# Altium schematic sheet PCB_LineFollowerFullPCB.schdoc
size 519 x 307 mm
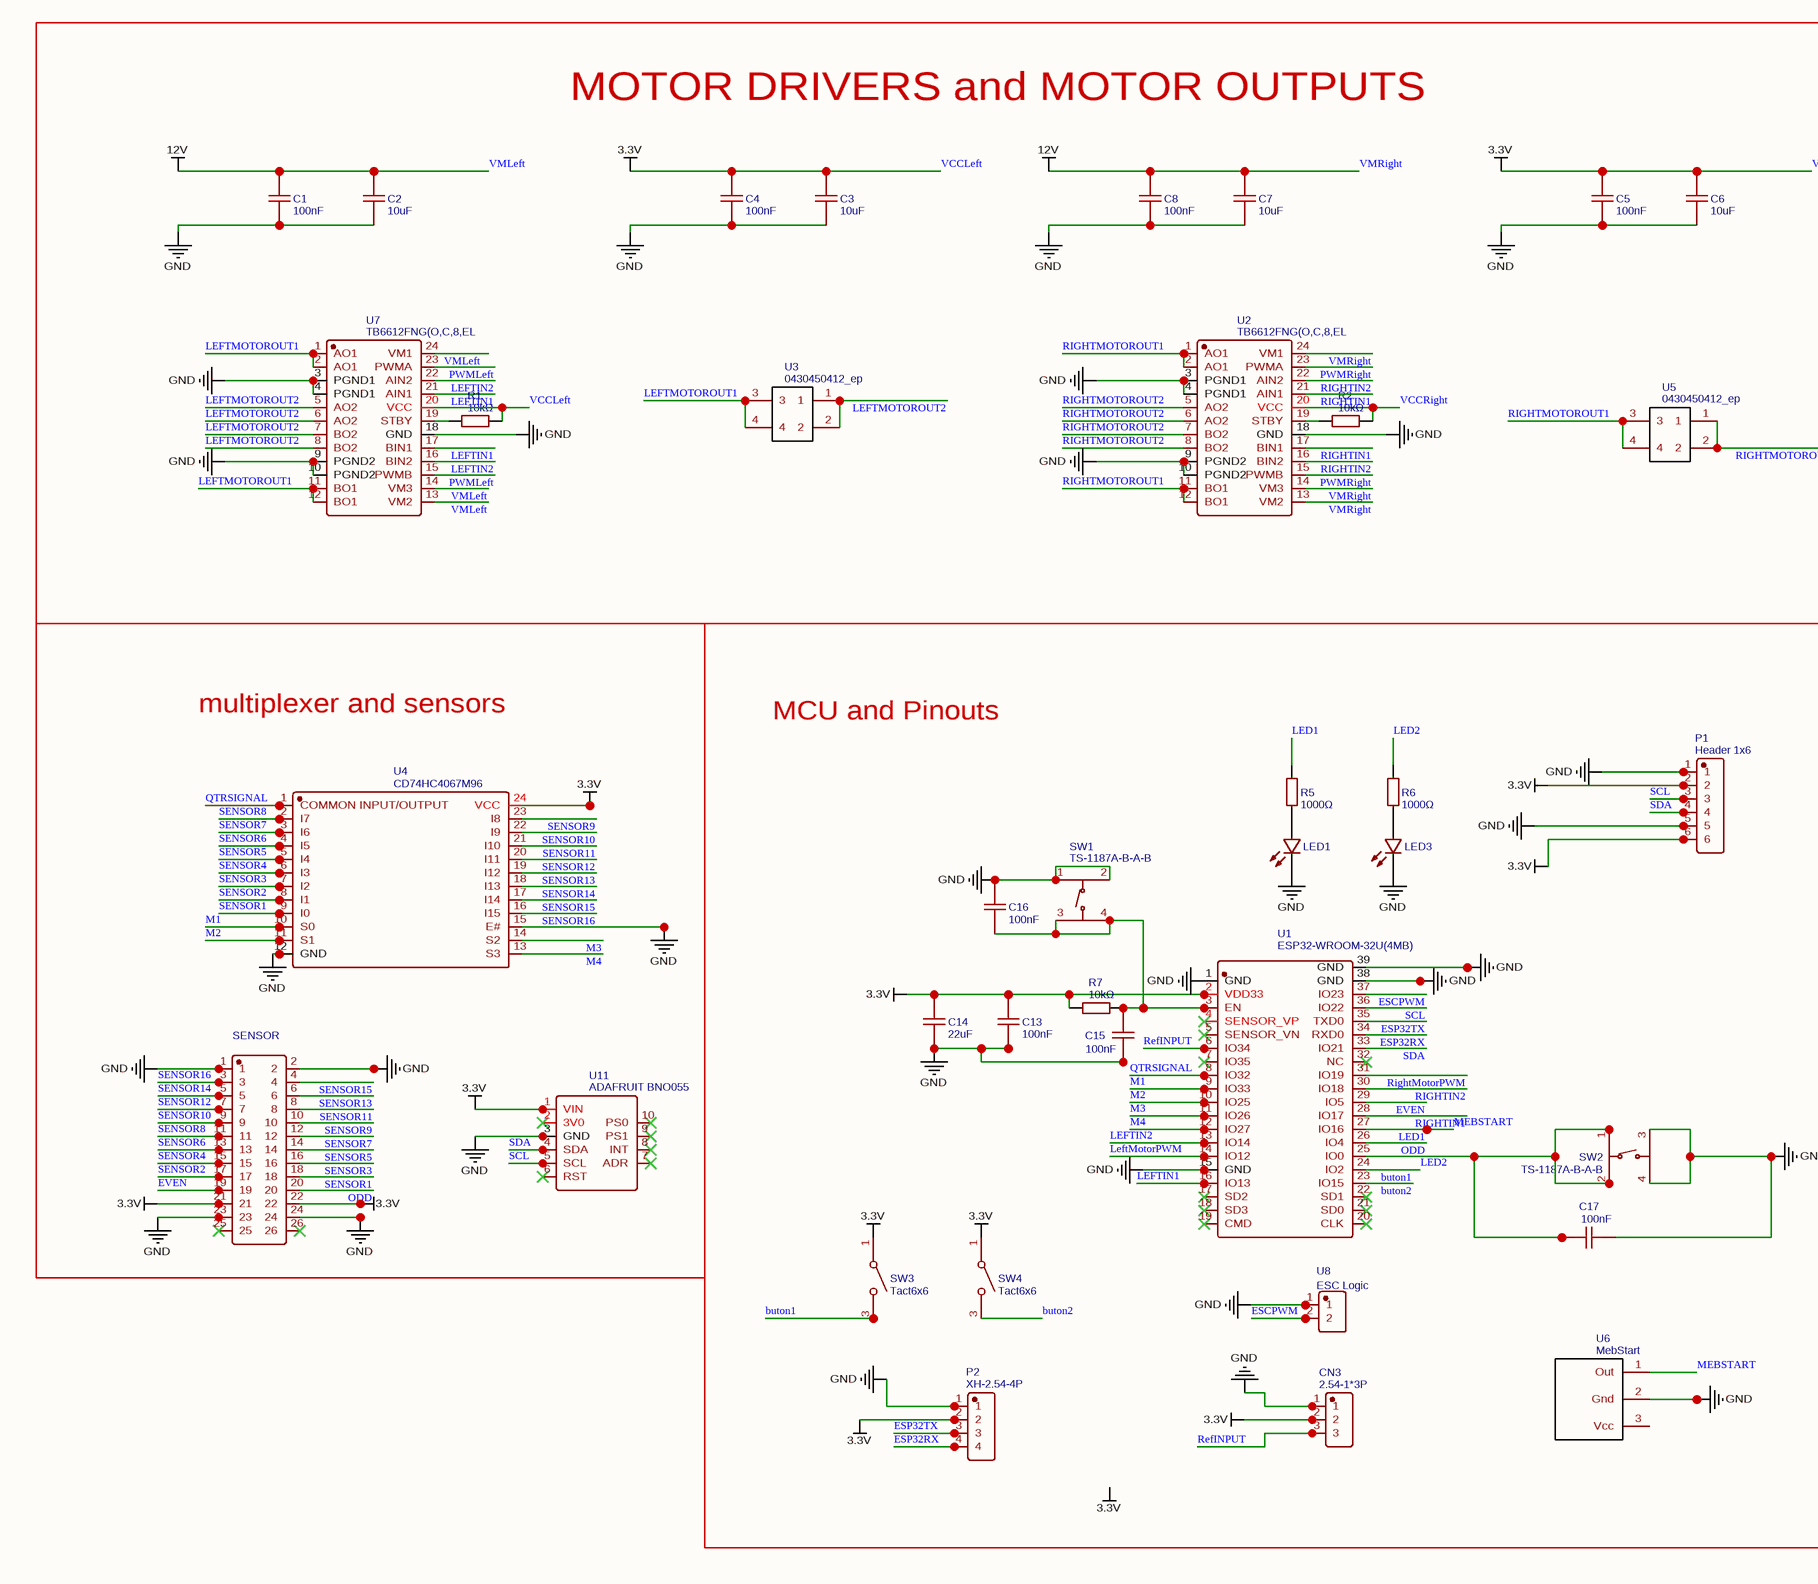
[diagram p0: PCB_LineFollowerFullPCB.schdoc, left]
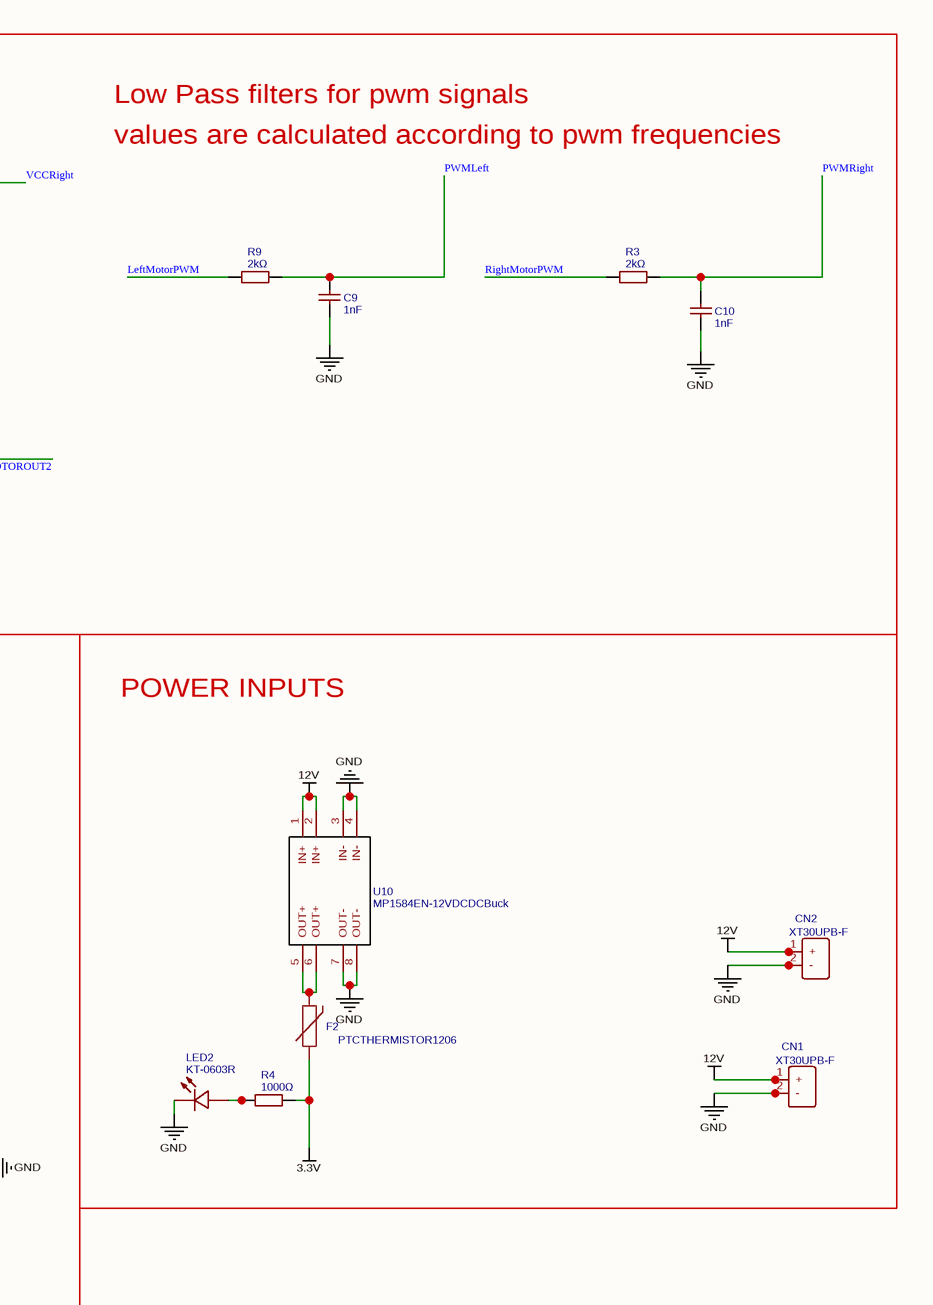
[diagram p1: PCB_LineFollowerFullPCB.schdoc, right]

## Parts
C1  100nF  [C0603]
C2  10uF  [C0603]
C3  10uF  [C0603]
C4  100nF  [C0603]
C5  100nF  [C0603]
C6  10uF  [C0603]
C7  10uF  [C0603]
C8  100nF  [C0603]
C9  1nF  [C0603]
C10  1nF  [C0603]
C13  100nF  [C0603]
C14  22uF  [C0603]
C15  100nF  [C0603]
C16  100nF  [C0603]
C17  100nF  [C0603]
CN1  XT30UPB-F  [CONN-TH_XT30UPB-F]
CN2  XT30UPB-F  [CONN-TH_XT30UPB-F]
CN3  2.54-1*3P  [CONN-TH_C722693]
F2  PTCTHERMISTOR1206  [PTC-1206]
LED1  19-217/BHC-ZL1M2RY/3T  [LED0603-FD_BLUE]  (value not drawn)
LED2  KT-0603R  [LED0603-RD]
LED3  19-217/BHC-ZL1M2RY/3T  [LED0603-FD_BLUE]  (value not drawn)
P1  Header 1x6  [1X6-PIN-HEADER-2.54MM_ES]
P2  XH-2.54-4P  [CONN-TH_4P-P2.50-XH2.54-4P]
R1  10kΩ  [R0603]
R2  10kΩ  [R0603]
R3  2kΩ  [R0603]
R4  1000Ω  [R0603]
R5  1000Ω  [R0603]
R6  1000Ω  [R0603]
R7  10kΩ  [R0603]
R9  2kΩ  [R0603]
SENSOR  X9555WV-2X13E-PTV01  [CONN-TH_26P-P2.54_XKB_X9555WV-2X13E-PTV01]  (value not drawn)
SW1  TS-1187A-B-A-B  [SW-SMD_4P-L5.1-W5.1-P3.70-LS6.5-TL-2]
SW2  TS-1187A-B-A-B  [SW-SMD_4P-L5.1-W5.1-P3.70-LS6.5-TL-2]
SW3  Tact6x6  [TACTILE_SWITCH_6X6]
SW4  Tact6x6  [TACTILE_SWITCH_6X6]
U1  ESP32-WROOM-32U(4MB)  [WIFI-SMD_ESP32-WROOM-32UE-A]
U2  TB6612FNG(O,C,8,EL  [SSOP-24_L8.4-W5.8-P0.65-LS7.8-BL]
U3  0430450412_ep  [0430450412_EP]
U4  CD74HC4067M96  [SOIC-24_L15.4-W7.5-P1.27-LS10.3-BL]
U5  0430450412_ep  [0430450412_EP]
U6  MebStart  [MEBSTART_MODUL]
U7  TB6612FNG(O,C,8,EL  [SSOP-24_L8.4-W5.8-P0.65-LS7.8-BL]
U8  ESC Logic  [CONN-TH_2P-P2.50-XH2.54-2P]
U10  MP1584EN-12VDCDCBuck  [MP1584]
U11  ADAFRUIT BNO055  [ADAFRUIT-BNO055_NO_HOLES]

## Blocks framed on the sheet
MOTOR DRIVERS and MOTOR OUTPUTS: C1-C10 R1-R3 R9 U2 U3 U5 U7
multiplexer and sensors: SENSOR U4 U11
MCU and Pinouts: C13-C17 CN3 LED1 LED3 P1 P2 R5-R7 SW1-SW4 U1 U6 U8
POWER INPUTS: CN1 CN2 F2 LED2 R4 U10

## Nets
GND: C1.2 C2.2 C3.2 C4.2 C5.2 C6.2 C7.2 C8.2 C9.2 C10.2 C13.2 C14.1 C15.2 C16.1 C17.2 CN1.2(-) CN2.2(-) CN3.1 LED1.1(C) LED2.1(K) LED3.1(C) P1.1 P1.5 P2.1 SENSOR.1 SENSOR.2 SENSOR.23 SENSOR.24 SW1.1(A) SW1.2(B) SW2.3(C) SW2.4(D) U1.1(GND) U1.15(GND) U1.38(GND) U1.39(GND) U2.3(PGND1) U2.4(PGND1) U2.9(PGND2) U2.10(PGND2) U2.18(GND) U4.12(GND) U4.15(E#) U6.2(Gnd) U7.3(PGND1) U7.4(PGND1) U7.9(PGND2) U7.10(PGND2) U7.18(GND) U8.1 U10.3(IN-) U10.4(IN-) U10.7(OUT-) U10.8(OUT-) U11.3(GND)
VCCLeft: C3.1 C4.1 C5.1 C6.1 C13.1 C14.2 CN3.2 F2.1 P1.2 P1.6 P2.2 R1.2 R2.2 R4.2 R7.1 SENSOR.21 SENSOR.22 SW3.1 SW4.1 U1.2(VDD33) U2.20(VCC) U4.24(VCC) U7.20(VCC) U11.1(VIN)  [also labelled 3.3V, VCCRight]
VMLeft: C1.1 C2.1 C7.1 C8.1 CN1.1(+) CN2.1(+) U2.13(VM2) U2.14(VM3) U2.24(VM1) U7.13(VM2) U7.14(VM3) U7.24(VM1) U10.1(IN+) U10.2(IN+)  [also labelled 12V, VMRight]
buton1: R6.1 SW3.3 U1.24(IO2)  [also labelled LED2]
buton2: SW4.3 U1.23(IO15)
ESCPWM: U1.37(IO23) U8.2
ESP32RX: P2.4 U1.34(RXD0)
ESP32TX: P2.3 U1.35(TXD0)
EVEN: SENSOR.19 U1.29(IO5)
LED1: R5.1 U1.27(IO16) U6.1(Out)  [also labelled MEBSTART]
LEFTIN1: U1.16(IO13) U7.17(BIN1) U7.21(AIN1)
LEFTIN2: U1.13(IO14) U7.16(BIN2) U7.22(AIN2)
LEFTMOTOROUT1: U3.3 U3.4 U7.1(AO1) U7.2(AO1) U7.11(BO1) U7.12(BO1)
LEFTMOTOROUT2: U3.1 U3.2 U7.5(AO2) U7.6(AO2) U7.7(BO2) U7.8(BO2)
LeftMotorPWM: R9.1 U1.14(IO12)
M1: U1.9(IO33) U4.10(S0)
M2: U1.10(IO25) U4.11(S1)
M3: U1.11(IO26) U4.14(S2)
M4: U1.12(IO27) U4.13(S3)
ODD: SENSOR.20 U1.26(IO4)
PWMLeft: C9.1 R9.2 U7.15(PWMB) U7.23(PWMA)
PWMRight: C10.1 R3.2 U2.15(PWMB) U2.23(PWMA)
QTRSIGNAL: U1.8(IO32) U4.1(COMMON_INPUT/OUTPUT)
RefINPUT: CN3.3 U1.6(IO34)
RIGHTIN1: U1.28(IO17) U2.17(BIN1) U2.21(AIN1)
RIGHTIN2: U1.30(IO18) U2.16(BIN2) U2.22(AIN2)
RIGHTMOTOROUT1: U2.1(AO1) U2.2(AO1) U2.11(BO1) U2.12(BO1) U5.3 U5.4
RIGHTMOTOROUT2: U2.5(AO2) U2.6(AO2) U2.7(BO2) U2.8(BO2) U5.1 U5.2
RightMotorPWM: R3.1 U1.31(IO19)
SCL: P1.3 U1.36(IO22) U11.5(SCL)
SDA: P1.4 U1.33(IO21) U11.4(SDA)
SENSOR1: SENSOR.18 U4.9(I0)
SENSOR2: SENSOR.17 U4.8(I1)
SENSOR3: SENSOR.16 U4.7(I2)
SENSOR4: SENSOR.15 U4.6(I3)
SENSOR5: SENSOR.14 U4.5(I4)
SENSOR6: SENSOR.13 U4.4(I5)
SENSOR7: SENSOR.12 U4.3(I6)
SENSOR8: SENSOR.11 U4.2(I7)
SENSOR9: SENSOR.10 U4.23(I8)
SENSOR10: SENSOR.9 U4.22(I9)
SENSOR11: SENSOR.8 U4.21(I10)
SENSOR12: SENSOR.7 U4.20(I11)
SENSOR13: SENSOR.6 U4.19(I12)
SENSOR14: SENSOR.5 U4.18(I13)
SENSOR15: SENSOR.4 U4.17(I14)
SENSOR16: SENSOR.3 U4.16(I15)
NetC15_1: C15.1 C16.2 R7.2 SW1.3(C) SW1.4(D) U1.3(EN)
NetC17_1: C17.1 SW2.1(A) SW2.2(B) U1.25(IO0)
NetF2_2: F2.2 U10.5(OUT+) U10.6(OUT+)
NetLED1_2: LED1.2(A) R5.2
NetLED2_2: LED2.2(A) R4.1
NetLED3_2: LED3.2(A) R6.2
NetR1_1: R1.1 U7.19(STBY)
NetR2_1: R2.1 U2.19(STBY)

Not connected (* = marked no-connect by the designer): SENSOR 25* 26*; U1 4(SENSOR_VP)* 5(SENSOR_VN)* 7(IO35)* 17(SD2)* 18(SD3)* 19(CMD)* 20(CLK)* 21(SD0)* 22(SD1)* 32(NC)*; U6 3(Vcc); U11 2(3V0)* 6(RST)* 7(ADR)* 8(INT)* 9(PS1)* 10(PS0)*

## Notes on the sheet
- Low Pass filters for pwm signals
- values are calculated according to pwm frequencies
- Labels drawn without touching a wire or pin: 3.3V

## Library data of the parts
C1 C4 C5 C8 C13 C15-C17 = 100nF: Manufacturer: YAGEO(国巨); Manufacturer Part: CC0603KRX7R9BB104; nameAlias: Value; Supplier: LCSC; Supplier Part: C14663; JLCPCB Part Class: Basic Part; link: https://lcsc.com/eda_search?q=C14663&%26type=1&ref=editor; spicePre: C; spiceSymbolName: CC0603KRX7R9BB104
C2 C3 C6 C7 = 10uF: Manufacturer: SAMSUNG(三星); Manufacturer Part: CL10A106MA8NRNC; nameAlias: Value; Supplier: LCSC; Supplier Part: C96446; JLCPCB Part Class: Basic Part; link: https://lcsc.com/eda_search?q=C96446&%26type=1&ref=editor; spicePre: C; spiceSymbolName: CL10A106MA8NRNC
C9 C10 = 1nF: Manufacturer Part: CL10B102KB8NNNC; Manufacturer: SAMSUNG(三星); nameAlias: Value; Supplier: LCSC; Supplier Part: C1588; JLCPCB Part Class: Basic Part; link: https://lcsc.com/eda_search?q=C1588&%26type=1&ref=editor; spicePre: C; spiceSymbolName: CL10B102KB8NNNC
C14 = 22uF: Manufacturer: SAMSUNG(三星); Manufacturer Part: CL10A226MQ8NRNC; nameAlias: Value; Supplier: LCSC; Supplier Part: C59461; JLCPCB Part Class: Basic Part; link: https://lcsc.com/eda_search?q=C59461&%26type=1&ref=editor; spicePre: C; spiceSymbolName: CL10A226MQ8NRNC
CN1 CN2 = XT30UPB-F: Manufacturer: AMASS(艾迈斯); Manufacturer Part: XT30UPB30-F.G.*; nameAlias: Value; Contributor: LCSC; Supplier: LCSC; Supplier Part: C108769; JLCPCB Part Class: Extended Part; link: https://lcsc.com/eda_search?q=C108769&%26type=1&ref=editor; spicePre: C; spiceSymbolName: XT30UPB-F
CN3 = 2.54-1*3P: Manufacturer: CAX(创都); Contributor: LCSC; Supplier: LCSC; Supplier Part: C722693; Manufacturer Part: 2.54-1*3P; JLCPCB Part Class: Extended Part; link: https://lcsc.com/eda_search?q=C722693&%26type=1&ref=editor; spicePre: C; spiceSymbolName: 2.54-1*3P
F2 = PTCTHERMISTOR1206: description: Resettable Fuse PTC; Contributor: varaksachin; spicePre: F; spiceSymbolName: PTCTHERMISTOR1206
LED1 LED3 = 19-217/BHC-ZL1M2RY/3T: Manufacturer: EVERLIGHT(亿光); Supplier: LCSC; Manufacturer Part: 19-217/BHC-ZL1M2RY/3T; Supplier Part: C72041; JLCPCB Part Class: Basic Part; link: https://lcsc.com/eda_search?q=C72041&%26type=1&ref=editor; spicePre: L; spiceSymbolName: 19-217/BHC-ZL1M2RY/3T
LED2 = KT-0603R: Manufacturer: KENTO; Supplier: LCSC; Manufacturer Part: KT-0603R; Supplier Part: C2286; JLCPCB Part Class: Basic Part; link: https://lcsc.com/eda_search?q=C2286&%26type=1&ref=editor; spicePre: L; spiceSymbolName: KT-0603R
P1 = Header 1x6: Manufacturer: XFCN; Manufacturer Part: M3025V-1x6P; Contributor: erzyk; Supplier: LCSC; Supplier Part: C705186; JLCPCB Part Class: Extended Part; spicePre: P; spiceSymbolName: Header 1x6
P2 = XH-2.54-4P: Manufacturer: null; Contributor: LCSC; Supplier: LCSC; Supplier Part: C9900003933; Manufacturer Part: XH-2.54-4P; JLCPCB Part Class: Extended Part; link: https://lcsc.com/eda_search?q=C9900003933&%26type=1&ref=editor; spicePre: P; spiceSymbolName: XH-2.54-4P
R1 R2 R7 = 10kΩ: Manufacturer: UNI-ROYAL(厚声); Manufacturer Part: 0603WAF1002T5E; nameAlias: Value; Supplier: LCSC; Supplier Part: C25804; JLCPCB Part Class: Basic Part; link: https://lcsc.com/eda_search?q=C25804&%26type=1&ref=editor; spicePre: R; spiceSymbolName: 0603WAF1002T5E
R3 R9 = 2kΩ: Manufacturer: UNI-ROYAL(厚声); Manufacturer Part: 0603WAF2001T5E; nameAlias: Value; Supplier: LCSC; Supplier Part: C22975; JLCPCB Part Class: Basic Part; link: https://lcsc.com/eda_search?q=C22975&%26type=1&ref=editor; spicePre: R; spiceSymbolName: 0603WAF2001T5E
R4 = 1000Ω: Manufacturer: UNI-ROYAL(厚声); Manufacturer Part: 0603WAF1000T5E; nameAlias: Value; Supplier: LCSC; Supplier Part: C22775; JLCPCB Part Class: Basic Part; link: https://lcsc.com/eda_search?q=C22775&%26type=1&ref=editor; spicePre: R; spiceSymbolName: 0603WAF1000T5E
R5 R6 = 1000Ω: Manufacturer: UNI-ROYAL(厚声); Manufacturer Part: 0603WAF510JT5E; nameAlias: Value; Supplier: LCSC; Supplier Part: C23197; JLCPCB Part Class: Basic Part; link: https://lcsc.com/eda_search?q=C23197&%26type=1&ref=editor; spicePre: R; spiceSymbolName: 0603WAF510JT5E
SENSOR = X9555WV-2X13E-PTV01: Manufacturer: XKB Connectivity(中国星坤); Contributor: LCSC; Supplier: LCSC; Supplier Part: C2884537; Manufacturer Part: X9555WV-2x13E-PTV01; JLCPCB Part Class: Extended Part; link: https://lcsc.com/eda_search?q=C2884537&%26type=1&ref=editor; spicePre: U; spiceSymbolName: X9555WV-2X13E-PTV01
SW1 SW2 = TS-1187A-B-A-B: Manufacturer: XKB Connectivity(中国星坤); Contributor: LCSC; Supplier: LCSC; Supplier Part: C318884; Manufacturer Part: TS-1187A-B-A-B; JLCPCB Part Class: Basic Part; link: https://lcsc.com/eda_search?q=C318884&%26type=1&ref=editor; spicePre: S; spiceSymbolName: TS-1187A-B-A-B
SW3 SW4 = Tact6x6: Manufacturer: BBJ; Manufacturer Part: Switch,6*6*6Plastic head,260G, 0.25mm,Straight line; Contributor: Richárd Tóth; Supplier Part: C71836; Supplier: LCSC; spicePre: S; spiceSymbolName: Tact6x6
U1 = ESP32-WROOM-32U(4MB): Manufacturer: ESPRESSIF(乐鑫); Manufacturer Part: ESP32-WROOM-32U-N4; Contributor: LCSC; Supplier: LCSC; Supplier Part: C2934572; JLCPCB Part Class: Extended Part; link: https://lcsc.com/eda_search?q=C2934572&%26type=1&ref=editor; spicePre: U; spiceSymbolName: ESP32-WROOM-32U(4MB)
U2 U7 = TB6612FNG(O,C,8,EL: Manufacturer: TOSHIBA(东芝); Supplier: LCSC; Manufacturer Part: TB6612FNG(O,C,8,EL; Supplier Part: C88224; JLCPCB Part Class: Extended Part; link: https://lcsc.com/eda_search?q=C88224&%26type=1&ref=editor; spicePre: U; spiceSymbolName: TB6612FNG(O,C,8,EL
U3 U5 = 0430450412_ep: Contributor: epsilor; spicePre: U; spiceSymbolName: 0430450412_ep
U4 = CD74HC4067M96: Manufacturer: TI(德州仪器); Contributor: LCSC; Supplier: LCSC; Supplier Part: C496123; Manufacturer Part: CD74HC4067M96; JLCPCB Part Class: Extended Part; link: https://lcsc.com/eda_search?q=C496123&%26type=1&ref=editor; spicePre: U; spiceSymbolName: CD74HC4067M96
U6 = MebStart: Contributor: cikkan; spicePre: U; spiceSymbolName: MebStart
U8 = ESC Logic: Manufacturer: null; Manufacturer Part: XH-2P-2.54; Contributor: LCSC; Convert to PCB: Yes; Add into BOM: Yes; Supplier: LCSC; Supplier Part: C9900003929; JLCPCB Part Class: Extended Part; link: https://lcsc.com/eda_search?q=C9900003929&%26type=1&ref=editor; spicePre: U; spiceSymbolName: XH-2P-2.54
U10 = MP1584EN-12VDCDCBuck: Manufacturer: eBoot; Contributor: pep9571; Manufacturer Part: MP1584EN; Supplier Part: MP1584EN; spicePre: U; spiceSymbolName: MP1584EN-12VDCDCBuck
U11 = ADAFRUIT BNO055: Contributor: andreastryph; spicePre: U; spiceSymbolName: ADAFRUIT BNO055